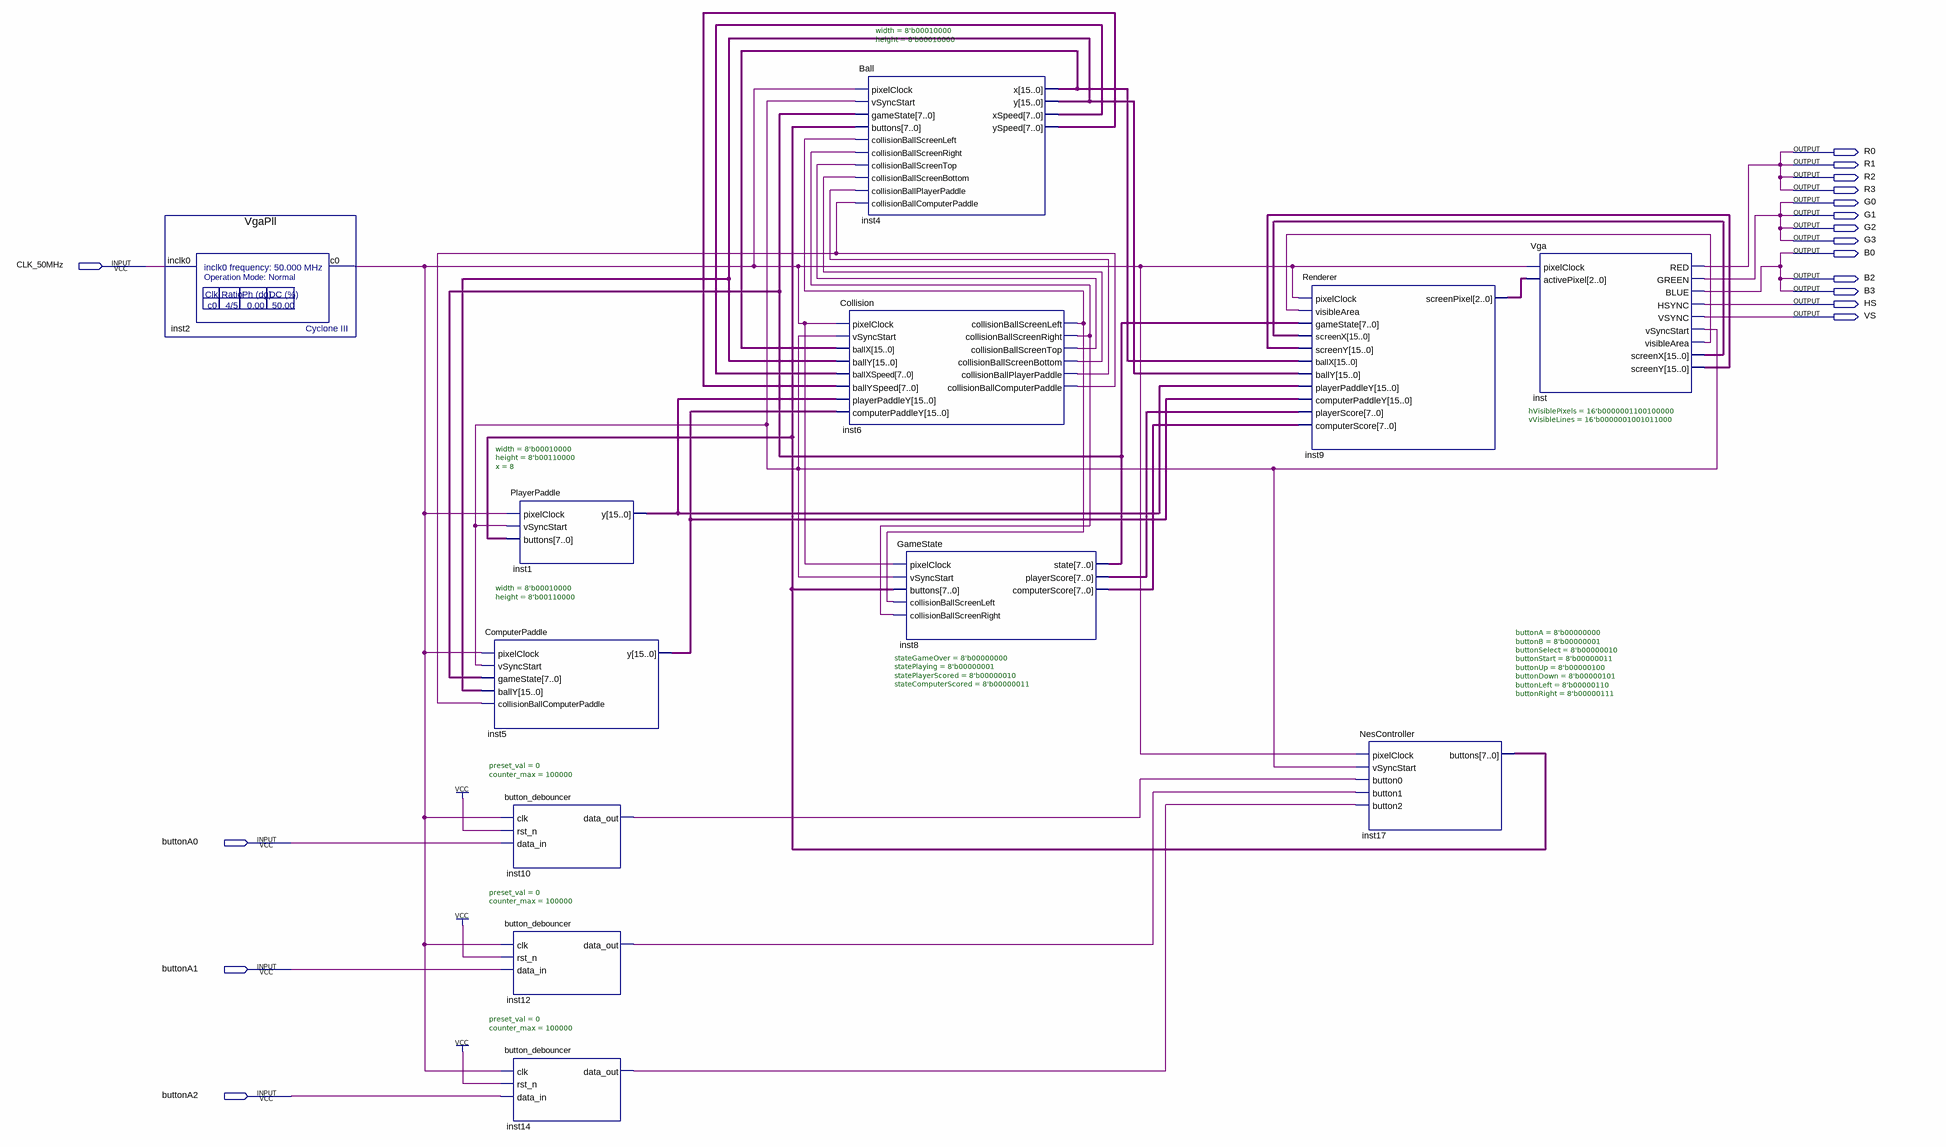
[diagram p0: schematic sheet]
// Quartus schematic FPGA-Project.bdf as structural Verilog: 12 symbols, 17 pins
module \FPGA-Project  (
  input  CLK_50MHz,
  input  buttonA0,
  input  buttonA1,
  input  buttonA2,
  output R0,
  output R1,
  output R2,
  output R3,
  output G0,
  output G1,
  output G2,
  output G3,
  output B0,
  output B2,
  output B3,
  output HS,
  output VS
);

  wire inst2_c0, inst6_collisionballcomputerpaddle, inst6_collisionballplayerpaddle,
       inst6_collisionballscreenbottom, inst6_collisionballscreenleft, inst6_collisionballscreenright,
       inst6_collisionballscreentop, inst10_data_out, inst12_data_out, inst14_data_out, inst_visiblearea,
       inst_vsyncstart;
  wire [2:0] inst9_screenpixel;
  wire [7:0] inst4_xspeed, inst4_yspeed, inst8_computerscore, inst8_playerscore, inst8_state, inst17_buttons;
  wire [15:0] inst1_y, inst4_x, inst4_y, inst5_y, inst_screenx, inst_screeny;

  VgaPll inst2 (.inclk0(CLK_50MHz), .c0(inst2_c0));
  ComputerPaddle #(.width(8'b00010000), .height(8'b00110000)) inst5 (
    .pixelClock(inst2_c0), .vSyncStart(inst_vsyncstart), .gameState(inst8_state), .ballY(inst4_y),
    .collisionBallComputerPaddle(inst6_collisionballcomputerpaddle), .y(inst5_y));
  PlayerPaddle #(.width(8'b00010000), .height(8'b00110000), .x(8)) inst1 (
    .pixelClock(inst2_c0), .vSyncStart(inst_vsyncstart), .buttons(inst17_buttons), .y(inst1_y));
  button_debouncer #(.preset_val(0), .counter_max(100000)) inst10 (
    .clk(inst2_c0), .rst_n(1'b1), .data_in(buttonA0), .data_out(inst10_data_out));
  button_debouncer #(.preset_val(0), .counter_max(100000)) inst12 (
    .clk(inst2_c0), .rst_n(1'b1), .data_in(buttonA1), .data_out(inst12_data_out));
  button_debouncer #(.preset_val(0), .counter_max(100000)) inst14 (
    .clk(inst2_c0), .rst_n(1'b1), .data_in(buttonA2), .data_out(inst14_data_out));
  Collision inst6 (
    .pixelClock(inst2_c0), .vSyncStart(inst_vsyncstart), .ballX(inst4_x), .ballY(inst4_y),
    .ballXSpeed(inst4_xspeed), .ballYSpeed(inst4_yspeed), .playerPaddleY(inst1_y), .computerPaddleY(inst5_y),
    .collisionBallScreenLeft(inst6_collisionballscreenleft),
    .collisionBallScreenRight(inst6_collisionballscreenright),
    .collisionBallScreenTop(inst6_collisionballscreentop),
    .collisionBallScreenBottom(inst6_collisionballscreenbottom),
    .collisionBallPlayerPaddle(inst6_collisionballplayerpaddle),
    .collisionBallComputerPaddle(inst6_collisionballcomputerpaddle));
  Ball #(.width(8'b00010000), .height(8'b00010000)) inst4 (
    .pixelClock(inst2_c0), .vSyncStart(inst_vsyncstart), .gameState(inst8_state), .buttons(inst17_buttons),
    .collisionBallScreenLeft(inst6_collisionballscreenleft),
    .collisionBallScreenRight(inst6_collisionballscreenright),
    .collisionBallScreenTop(inst6_collisionballscreentop),
    .collisionBallScreenBottom(inst6_collisionballscreenbottom),
    .collisionBallPlayerPaddle(inst6_collisionballplayerpaddle),
    .collisionBallComputerPaddle(inst6_collisionballcomputerpaddle), .x(inst4_x), .y(inst4_y),
    .xSpeed(inst4_xspeed), .ySpeed(inst4_yspeed));
  GameState #(.stateGameOver(8'b00000000), .statePlaying(8'b00000001), .statePlayerScored(8'b00000010), .stateComputerScored(8'b00000011)) inst8 (
    .pixelClock(inst2_c0), .vSyncStart(inst_vsyncstart), .buttons(inst17_buttons),
    .collisionBallScreenLeft(inst6_collisionballscreenleft),
    .collisionBallScreenRight(inst6_collisionballscreenright), .state(inst8_state),
    .playerScore(inst8_playerscore), .computerScore(inst8_computerscore));
  Renderer inst9 (
    .pixelClock(inst2_c0), .visibleArea(inst_visiblearea), .gameState(inst8_state), .screenX(inst_screenx),
    .screenY(inst_screeny), .ballX(inst4_x), .ballY(inst4_y), .playerPaddleY(inst1_y),
    .computerPaddleY(inst5_y), .playerScore(inst8_playerscore), .computerScore(inst8_computerscore),
    .screenPixel(inst9_screenpixel));
  NesController #(.buttonA(8'b00000000), .buttonB(8'b00000001), .buttonSelect(8'b00000010), .buttonStart(8'b00000011), .buttonUp(8'b00000100), .buttonDown(8'b00000101), .buttonLeft(8'b00000110), .buttonRight(8'b00000111)) inst17 (
    .pixelClock(inst2_c0), .vSyncStart(inst_vsyncstart), .button0(inst10_data_out),
    .button1(inst12_data_out), .button2(inst14_data_out), .buttons(inst17_buttons));
  Vga #(.hVisiblePixels(16'b0000001100100000), .vVisibleLines(16'b0000001001011000)) inst (
    .pixelClock(inst2_c0), .activePixel(inst9_screenpixel), .RED(R0), .GREEN(G0), .BLUE(B0), .HSYNC(HS),
    .VSYNC(VS), .vSyncStart(inst_vsyncstart), .visibleArea(inst_visiblearea), .screenX(inst_screenx),
    .screenY(inst_screeny));

  assign B2 = B0;
  assign B3 = B0;
  assign G1 = G0;
  assign G2 = G0;
  assign G3 = G0;
  assign R1 = R0;
  assign R2 = R0;
  assign R3 = R0;
endmodule
